# Altium schematic sheet TLM_002_ESP32S3.SchDoc: =DocumentName
size A4; CompanyName: Scopa Industries LLC; Engineer: Nazar Lysenko / Andrii Antonenko; Organization: Scopa Industries LLC; Address1: Kyiv; Address2: Ukraine; Address3: https://www.scopa.industries/; Address4: oleksyi.y@scopa.industries; SheetNumber: 2; SheetTotal: 11
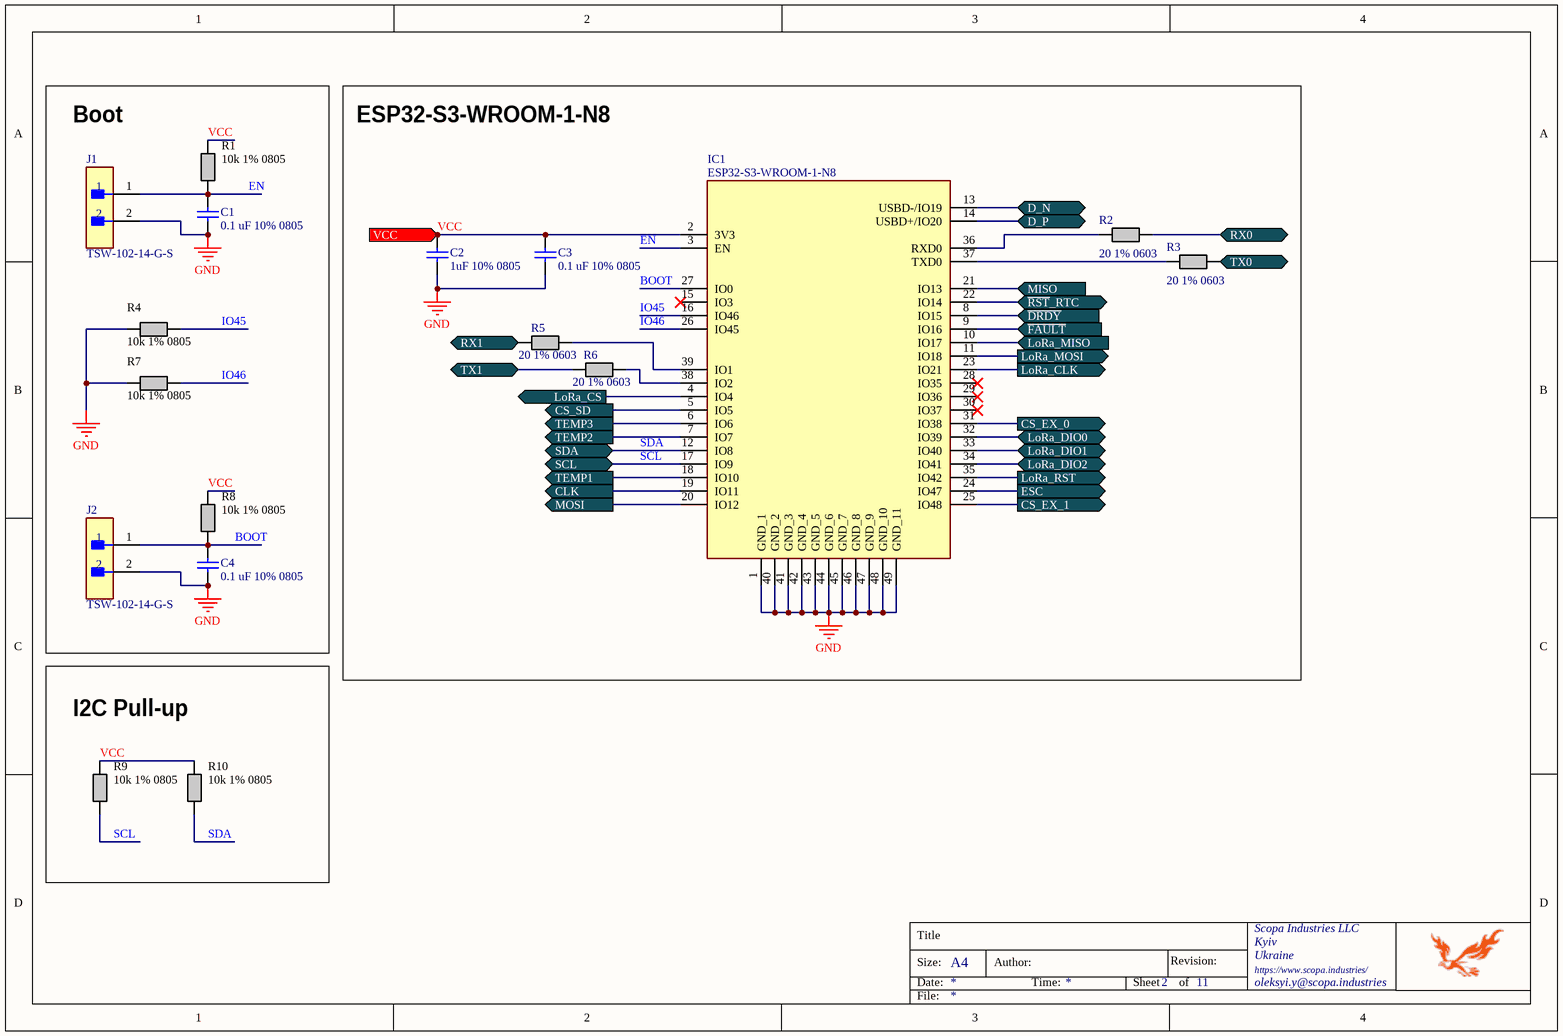
[diagram p0: TLM_002_ESP32S3.SchDoc]

## Parts
C1  0.1 uF 10% 0805  [CAPC2013X140X50ML20T25]
C2  1uF 10% 0805  [CAPC2013X145X50NL20T20]
C3  0.1 uF 10% 0805  [CAPC2013X140X50ML20T25]
C4  0.1 uF 10% 0805  [CAPC2013X140X50ML20T25]
IC1  ESP32-S3-WROOM-1-N8  [ESP32S3WROOM1N8R2]
J1  TSW-102-14-G-S  [FP-TSW-102-14-G-S-MFG]
J2  TSW-102-14-G-S  [FP-TSW-102-14-G-S-MFG]
R1  10k 1% 0805  [RES_0805]
R2  20 1% 0603  [RES_0603]
R3  20 1% 0603  [RES_0603]
R4  10k 1% 0805  [RES_0805]
R5  20 1% 0603  [RES_0603]
R6  20 1% 0603  [RES_0603]
R7  10k 1% 0805  [RES_0805]
R8  10k 1% 0805  [RES_0805]
R9  10k 1% 0805  [RES_0805]
R10  10k 1% 0805  [RES_0805]

## Ports
CLK (out, see TLM_002_MBR[1C], TLM_002_CONNECT[1B], TLM_002_MAX6675[2B], TLM_002_MAX31856[2B], TLM_002_SD[3B]), CS_EX_0 (out, see TLM_002_MBR[2C], TLM_002_CONNECT[1B]), CS_EX_1 (out, see TLM_002_MBR[2C], TLM_002_CONNECT[1B]), CS_SD (out, see TLM_002_MBR[2C]), D_N (bidir, see TLM_002_MBR[1C], TLM_002_CONNECT[1B], TLM_002_SRC[2C]), D_P (bidir, see TLM_002_MBR[1C], TLM_002_CONNECT[1B], TLM_002_SRC[2C]), ESC (out, see TLM_002_MBR[2D], TLM_002_CONNECT[4A]), LoRa_CLK (out, see TLM_002_MBR[2C]), LoRa_CS (out, see TLM_002_MBR[2D]), LoRa_DIO0 (bidir, see TLM_002_MBR[2C]), LoRa_DIO1 (bidir, see TLM_002_MBR[2C]), LoRa_DIO2 (bidir, see TLM_002_MBR[2C]), LoRa_MISO (in, see TLM_002_MBR[2C]), LoRa_MOSI (out, see TLM_002_MBR[2C]), LoRa_RST (out, see TLM_002_MBR[2C]), MISO (in, see TLM_002_MBR[1C], TLM_002_CONNECT[1A], TLM_002_MAX6675[2B], TLM_002_MAX31856[2B], TLM_002_SD[3B]), MOSI (out, see TLM_002_MBR[1C], TLM_002_CONNECT[1A], TLM_002_MAX31856[2B], TLM_002_SD[3B]), RX0 (bidir, see TLM_002_MBR[2D], TLM_002_CONNECT[1B]), RX1 (bidir, see TLM_002_MBR[2D], TLM_002_CONNECT[1B]), SCL (bidir, see TLM_002_MBR[1C], TLM_002_CONNECT[1B], TLM_002_DS3231SN_RTC[2B], TLM_002_INA228[2B], TLM_002_MCP3021[4B]), SDA (bidir, see TLM_002_MBR[1C], TLM_002_CONNECT[1B], TLM_002_DS3231SN_RTC[2B], TLM_002_INA228[2B], TLM_002_MCP3021[3B]), TEMP1 (out, see TLM_002_MBR[2B], TLM_002_CONNECT[1B]), TEMP2 (out, see TLM_002_MBR[2B], TLM_002_CONNECT[1B]), TEMP3 (out, see TLM_002_MBR[2C], TLM_002_CONNECT[1B]), TX0 (bidir, see TLM_002_MBR[2D], TLM_002_CONNECT[1B]), TX1 (bidir, see TLM_002_MBR[2D], TLM_002_CONNECT[1B]), VCC (in, see TLM_002_MBR[1B], TLM_002_DS3231SN_RTC[2B], TLM_002_INA228[1B], TLM_002_LoRa[2B], TLM_002_MAX6675[2B], TLM_002_MAX31856[1B], TLM_002_MCP3021[3B], TLM_002_SD[1B]), ~{DRDY} (in, see TLM_002_MBR[2C]), ~{FAULT} (in, see TLM_002_MBR[2C]), ~{RST}_RTC (bidir, see TLM_002_MBR[2C], TLM_002_DS3231SN_RTC[3B])

## Nets
GND: C1.1 C2.1 C3.1 C4.1 IC1.1(GND_1) IC1.40(GND_2) IC1.41(GND_3) IC1.42(GND_4) IC1.43(GND_5) IC1.44(GND_6) IC1.45(GND_7) IC1.46(GND_8) IC1.47(GND_9) IC1.48(GND_10) IC1.49(GND_11) J1.2 J2.2 R4.1 R7.1
BOOT: C4.2 IC1.27(IO0) J2.1 R8.2
CLK: IC1.19(IO11) ; port CLK
CS_EX_0: IC1.31(IO38) ; port CS_EX_0
CS_EX_1: IC1.25(IO48) ; port CS_EX_1
CS_SD: IC1.5(IO5) ; port CS_SD
~{DRDY}: IC1.8(IO15) ; port ~{DRDY}
D_N: IC1.13(USBD-/IO19) ; port D_N
D_P: IC1.14(USBD+/IO20) ; port D_P
EN: C1.2 IC1.3(EN) J1.1 R1.2
ESC: IC1.24(IO47) ; port ESC
~{FAULT}: IC1.9(IO16) ; port ~{FAULT}
IO45: IC1.16(IO46) R4.2
IO46: IC1.26(IO45) R7.2
LoRa_CLK: IC1.23(IO21) ; port LoRa_CLK
LoRa_CS: IC1.4(IO4) ; port LoRa_CS
LoRa_DIO0: IC1.32(IO39) ; port LoRa_DIO0
LoRa_DIO1: IC1.33(IO40) ; port LoRa_DIO1
LoRa_DIO2: IC1.34(IO41) ; port LoRa_DIO2
LoRa_MISO: IC1.10(IO17) ; port LoRa_MISO
LoRa_MOSI: IC1.11(IO18) ; port LoRa_MOSI
LoRa_RST: IC1.35(IO42) ; port LoRa_RST
MISO: IC1.21(IO13) ; port MISO
MOSI: IC1.20(IO12) ; port MOSI
~{RST}_RTC: IC1.22(IO14) ; port ~{RST}_RTC
RX0: R2.2 ; port RX0
RX1: R5.1 ; port RX1
SCL: IC1.17(IO9) R9.2 ; port SCL
SDA: IC1.12(IO8) R10.2 ; port SDA
TEMP1: IC1.18(IO10) ; port TEMP1
TEMP2: IC1.7(IO7) ; port TEMP2
TEMP3: IC1.6(IO6) ; port TEMP3
TX0: R3.2 ; port TX0
TX1: R6.1 ; port TX1
VCC: C2.2 C3.2 IC1.2(3V3) R1.1 R8.1 R9.1 R10.1 ; port VCC
NetIC1_36: IC1.36(RXD0) R2.1
NetIC1_37: IC1.37(TXD0) R3.1
NetIC1_38: IC1.38(IO2) R6.2
NetIC1_39: IC1.39(IO1) R5.2

Not connected (* = marked no-connect by the designer): IC1 15(IO3)* 28(IO35)* 29(IO36)* 30(IO37)*

## Notes on the sheet
- (near R1) Boot configuration
- ESP32-S3-WROOM-1-N8
- I2C Pull-up
- Title
- Size:
- Date:
- A4
- Author:
- Time:
- Sheet
- Revision:
- of
- File:

## Library data of the parts
C1 C3 C4 = CMP-2007-04651-1: Part Number: 0805DD104KAT2A; Manufacturer: AVX Interconnect / Elco
C2 = CMP-2007-01676-1: Part Number: VJ0805Y105KXQRW1BC; Manufacturer: Vitramon
IC1 = ESP32-S3-WROOM-1-N8: Integrated Circuit; Manufacturer_Name: Espressif Systems; Datasheet Link: https://www.espressif.com/sites/default/files/documentation/esp32-s3-wroom-1_wroom-1u_datasheet_en.pdf; Height: 3.25mm; Manufacturer_Part_Number: ESP32-S3-WROOM-1-N8; Mouser Part Number: 356-ESP32-S3WROOM1N8; Mouser Price/Stock: https://www.mouser.co.uk/ProductDetail/Espressif-Systems/ESP32-S3-WROOM-1-N8?qs=Wj%2FVkw3K%252BMC1mq0KGPvoSQ%3D%3D
J1 J2 = CMP-02766-001740-1: CONN HEADER VERT 2POS 2.54MM; Number of Positions: 2; Max Current Rating: 7.6A; Gender: Male; Max Voltage Rating (AC): 550V; Contact Mating Length: 0.32inch; REACH SVHC: No SVHC; Width: 2.54mm; Insulation Material: PBT; Contact Shape: Square; Contact Plating: Gold; Min Operating Temperature: -55°C; Contact Material: Bronze; Color: Black; Number of Contacts: 2; Housing Material: Polyester; Orientation: Straight; Flammability Rating: UL94 V-0; Max Operating Temperature: 125°C; Contact Type: Male Pin; Radiation Hardening: No; Termination: Solder; RoHS Compliant: Yes; Lead Free: Lead Free; Fastening Type: Pull; Pitch: 2.54mm; Number of Rows: 1; Series: TSW; Insulation Color: Black; Package Quantity: 1; Connector Type: Header; Length: 5.08mm; Contact Finish - Mating: GOLD; Mount: Through Hole; Housing Color: Black; Depth: 2.54mm; Packaging: Bulk
R1 R4 R7-R10 = Resistor_10k: Resistor 10kOhm 1% SMD 0805 Generic; Package size: 0805; Tolerance: 1%; Value: 10k
R2 R3 R5 R6 = Resistor_20: Resistor 20Ohm 1% SMD 0603 Generic; Value: 20; Package size: 0805; Tolerance: 1%